# Altium schematic sheet 20D_radio_simulator.SchDoc
size A4
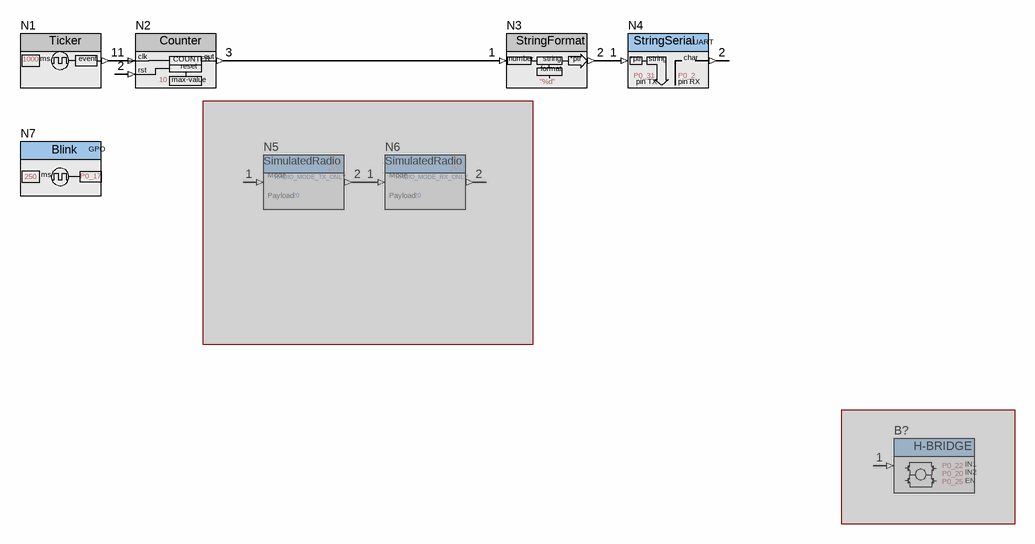
[diagram p0: 20D_radio_simulator.SchDoc]

## Parts
B?  nBlocksParameter3: P0_25  nBlocksParameter2: P0_20  nBlocksParameter1: P0_22  (hidden comment: L298)  (masked out: inside a compile mask, not in the netlist)
N1  Ticker  nBlocksParameter1: 1000
N2  Counter  nBlocksParameter1: 10
N3  StringFormat  nBlocksParameter1: "%d"
N4  StringSerial  nBlocksParameter2: P0_2  nBlocksParameter1: P0_31
N5  SimulatedRadio  nBlocksParameter1: RADIO_MODE_TX_ONLY  Parameter 2: Payload  Parameter 1: Mode  nBlocksParameter2: 20  (masked out: inside a compile mask, not in the netlist)
N6  SimulatedRadio  nBlocksParameter1: RADIO_MODE_RX_ONLY  Parameter 2: Payload  Parameter 1: Mode  nBlocksParameter2: 20  (masked out: inside a compile mask, not in the netlist)
N7  Blink  nBlocksParameter2: P0_17  nBlocksParameter1: 250

## Nets
NetN2_3: N2.3(OUT) N3.1(IN)
NetN3_2: N3.2(OUT) N4.1(TX)

Not connected (* = marked no-connect by the designer): N1 1(OUT); N2 1(COUNT-IN) 2(RESET); N4 2(RX)

## Notes on the sheet
- (in symbol NODE-BLINK) GPO; ms
- (in symbol NODE-COUNTER) clk; out; COUNTER; rst; reset; max-value
- (in symbol NODE-L298) H-BRIDGE
- (in symbol NODE-STRINGFORMAT) number; string; *ptr; format
- (in symbol NODE-STRINGSERIAL) UART; *ptr; string; char; pin TX; pin RX
- (in symbol NODE-TICKER) ms; event

## Library data of the parts
B? = NODE-L298: INA219 26V, 12-bit, i2c output current/voltage/power monitor API; Parameter 2: IN2; Parameter 1: IN1; Parameter 3: EN; ComponentLink1Description: link; ComponentLink1URL: https://github.com/nBlocksStudioNodes/nblocks_l298
N1 = NODE-TICKER: Creates a Periodical Event; ComponentLink1Description: link; ComponentLink1URL: https://github.com/nBlocksStudioNodes/nblocks_ticker
N2 = NODE-COUNTER: Ressetable Counter. Returns to zero, when max-value is reached; Parameter 1: AutoResetValue; ComponentLink1Description: link; ComponentLink1URL: https://github.com/nBlocksStudioNodes/nblocks_counter
N3 = NODE-STRINGFORMAT: Parameter 1: formatString; ComponentLink1Description: link; ComponentLink1URL: https://github.com/nBlocksStudioNodes/nblocks_stringformat
N4 = NODE-STRINGSERIAL: This node implements a serial port, where characters received from the external world (RX pin) are sent one by one to the node's output, but the node's input expects a full string object as input (sent entirely within one frame to the TX pin). / DO NOT CONNECT integer data into this node, as it will definitely lead to incorrect behaviour, sending random bytes in unpredicted amount to the serial port. This can be harmful depending on your design.; Parameter 2: pinRX; Parameter 1: pinTX; ComponentLink1Description: link; ComponentLink1URL: https://github.com/nBlocksStudioNodes/nblocks_stringserial
N5 N6 = NODE-SimulatedRadio: # SimulatedRadio / Simulated Radio Node to support Radio development. It can be used in place of Radio_Nodes, like nRF51xRadio or LoRaRadio / Two (2) Parameters: / *  Mode:  RADIO_MODE_TX_ONLY, RADIO_MODE_RX_ONLY / *  Payload: max 32 (Placeholder for future use, Any Payload up-to 64 Bytes will work); ComponentLink1Description: link; ComponentLink1URL: https://github.com/nBlocksStudioNodes/nblocks_simulatedradio
N7 = NODE-BLINK: Blink Node. Can be used for LED blinking or GPIO pulsing; Parameter 2: pinOut; Parameter 1: period(ms); ComponentLink1Description: link; ComponentLink1URL: https://github.com/nBlocksStudioNodes/nblocks_blink